# EAGLE board GEVCU-6-2c (EAGLE 6.6.0), part 1 of 2
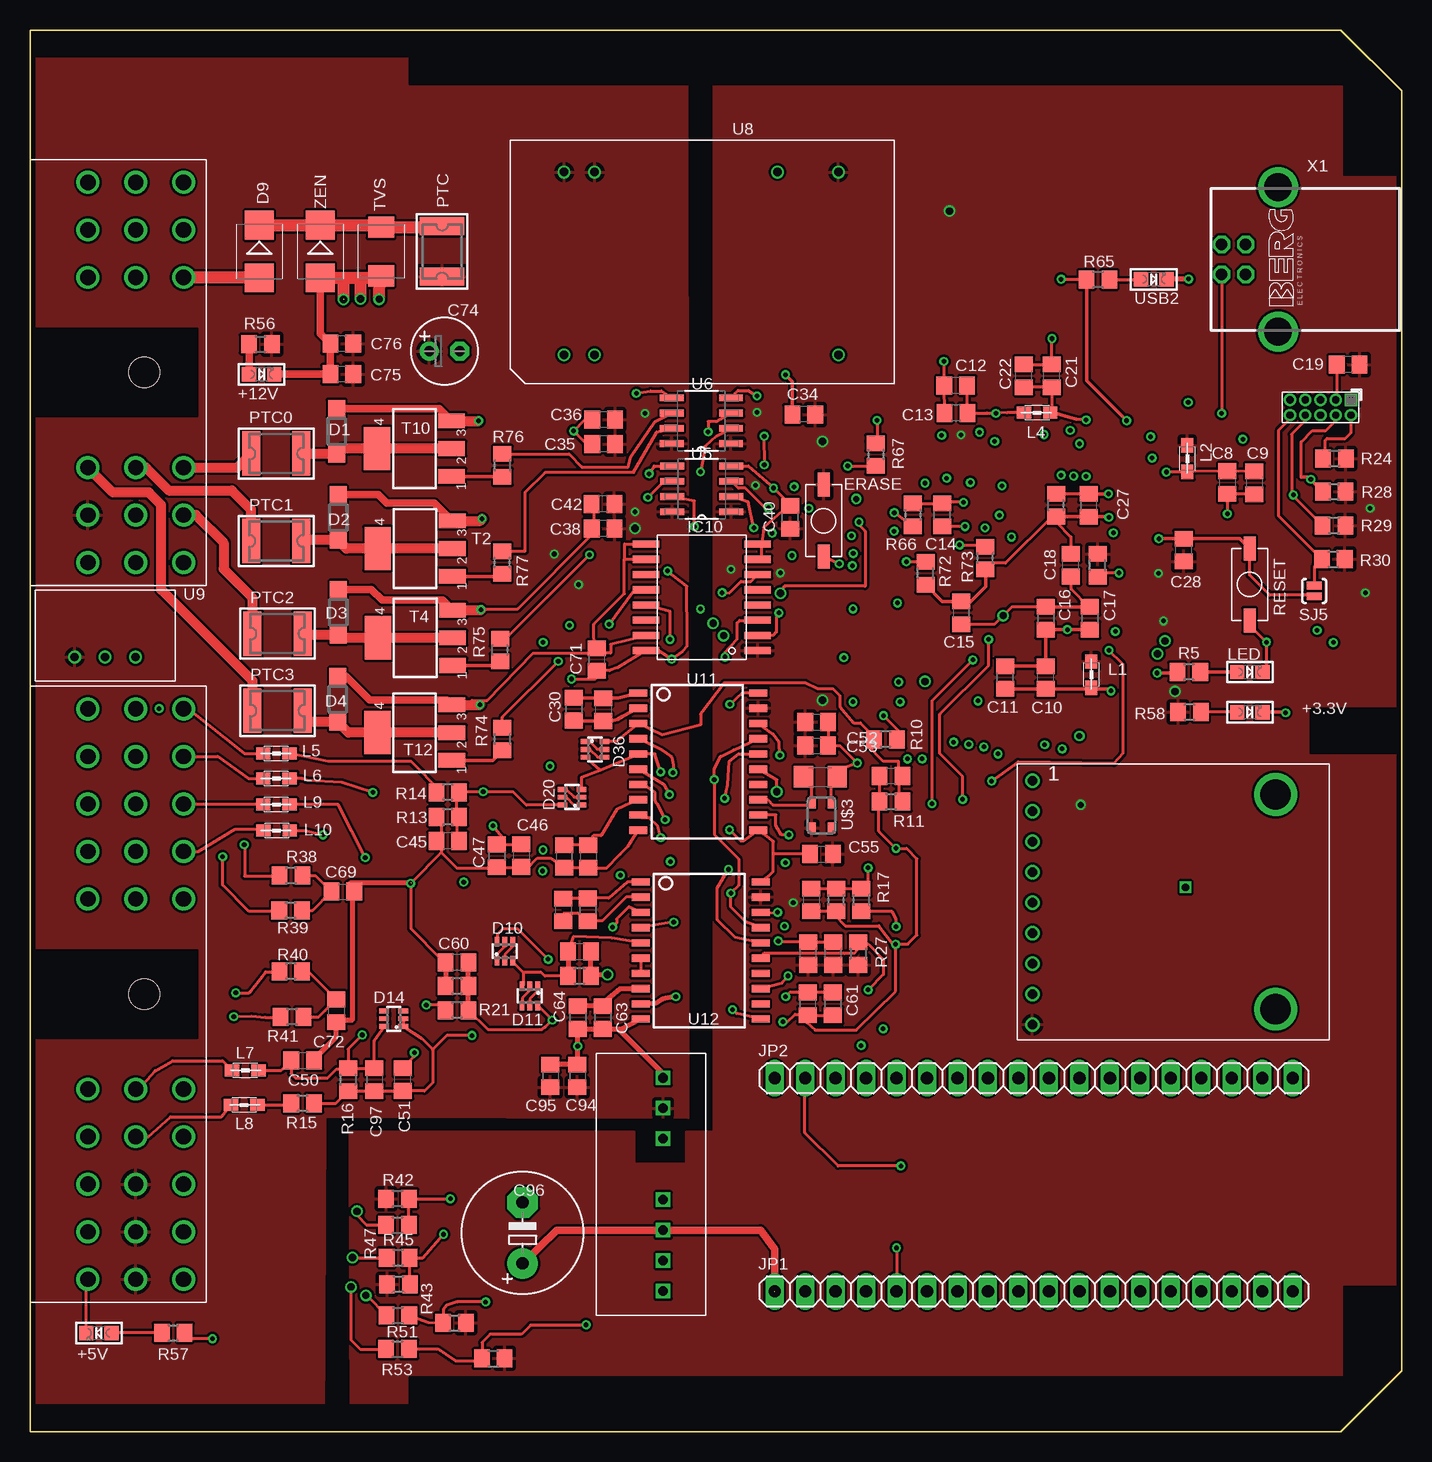
[diagram p2: board, top side]
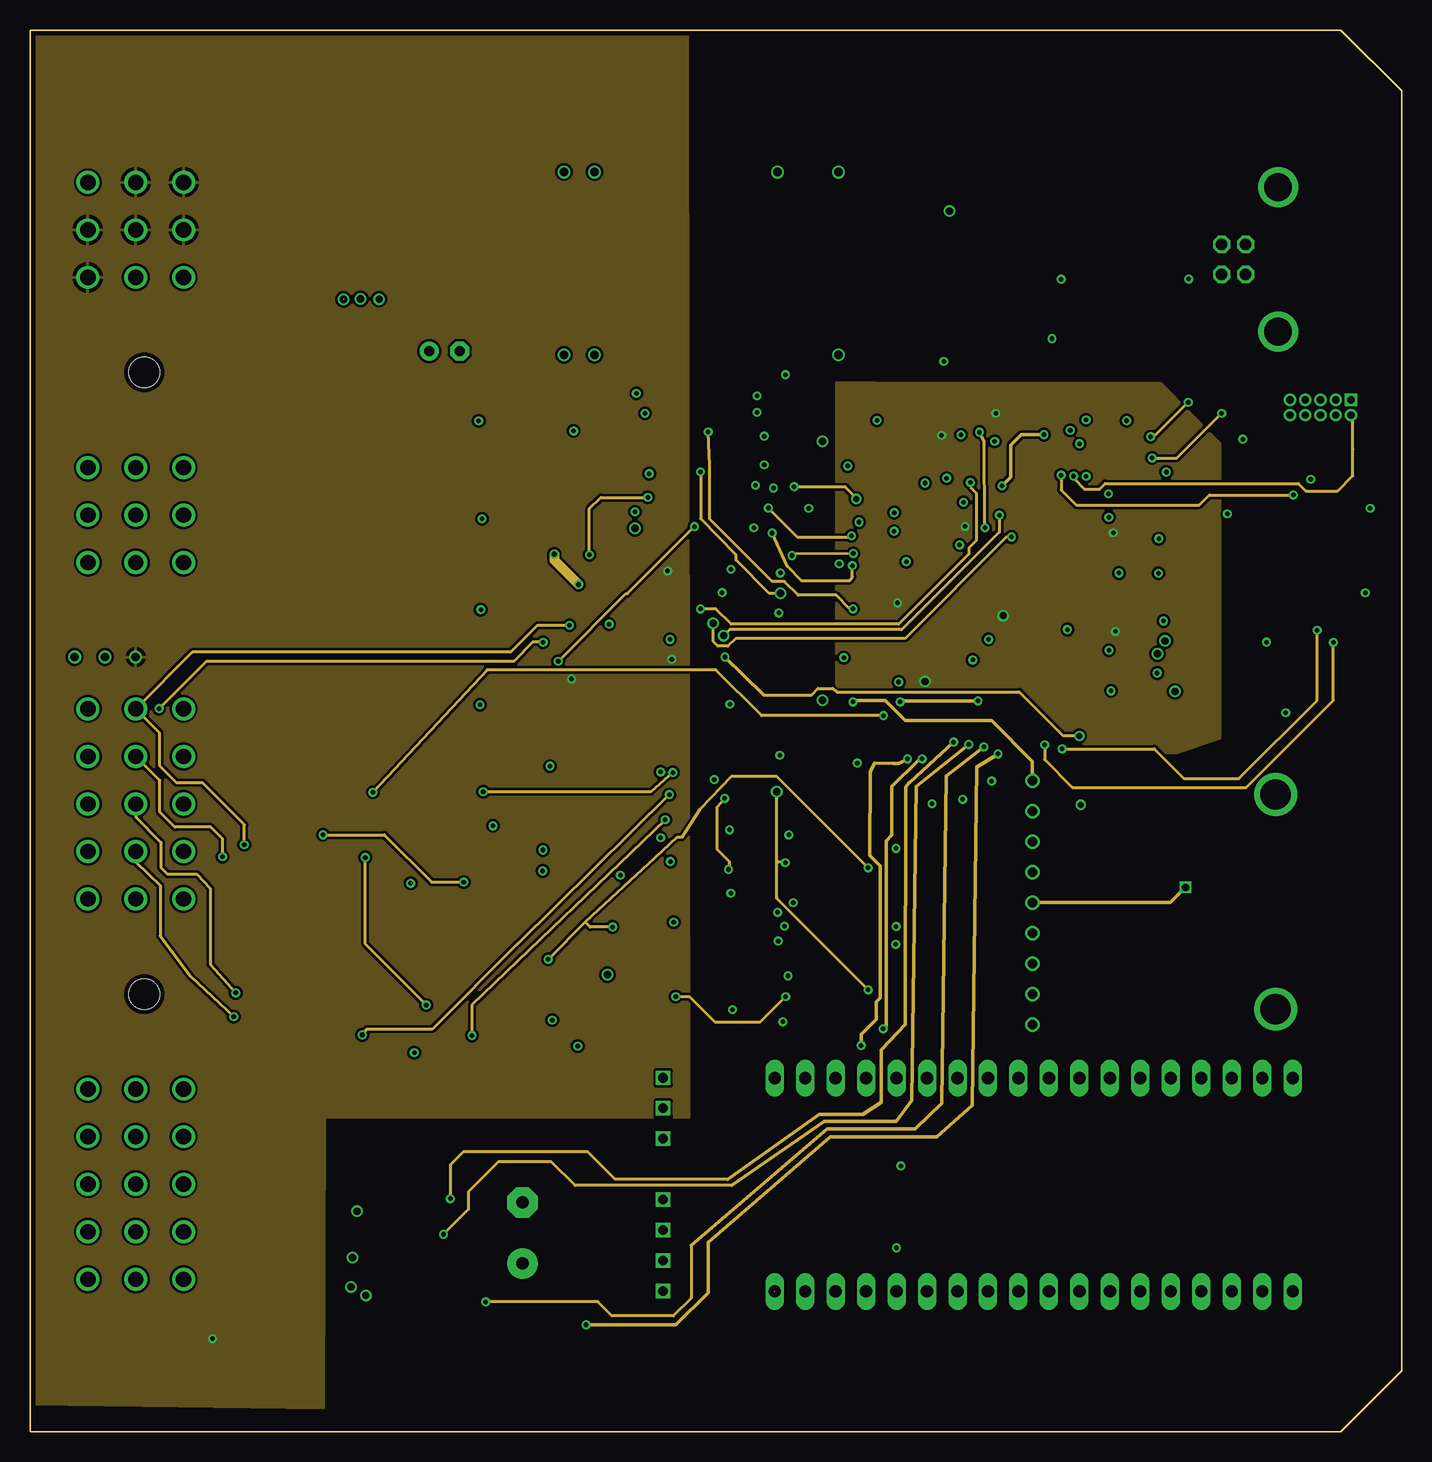
[diagram p3: board, inner layer Route2]
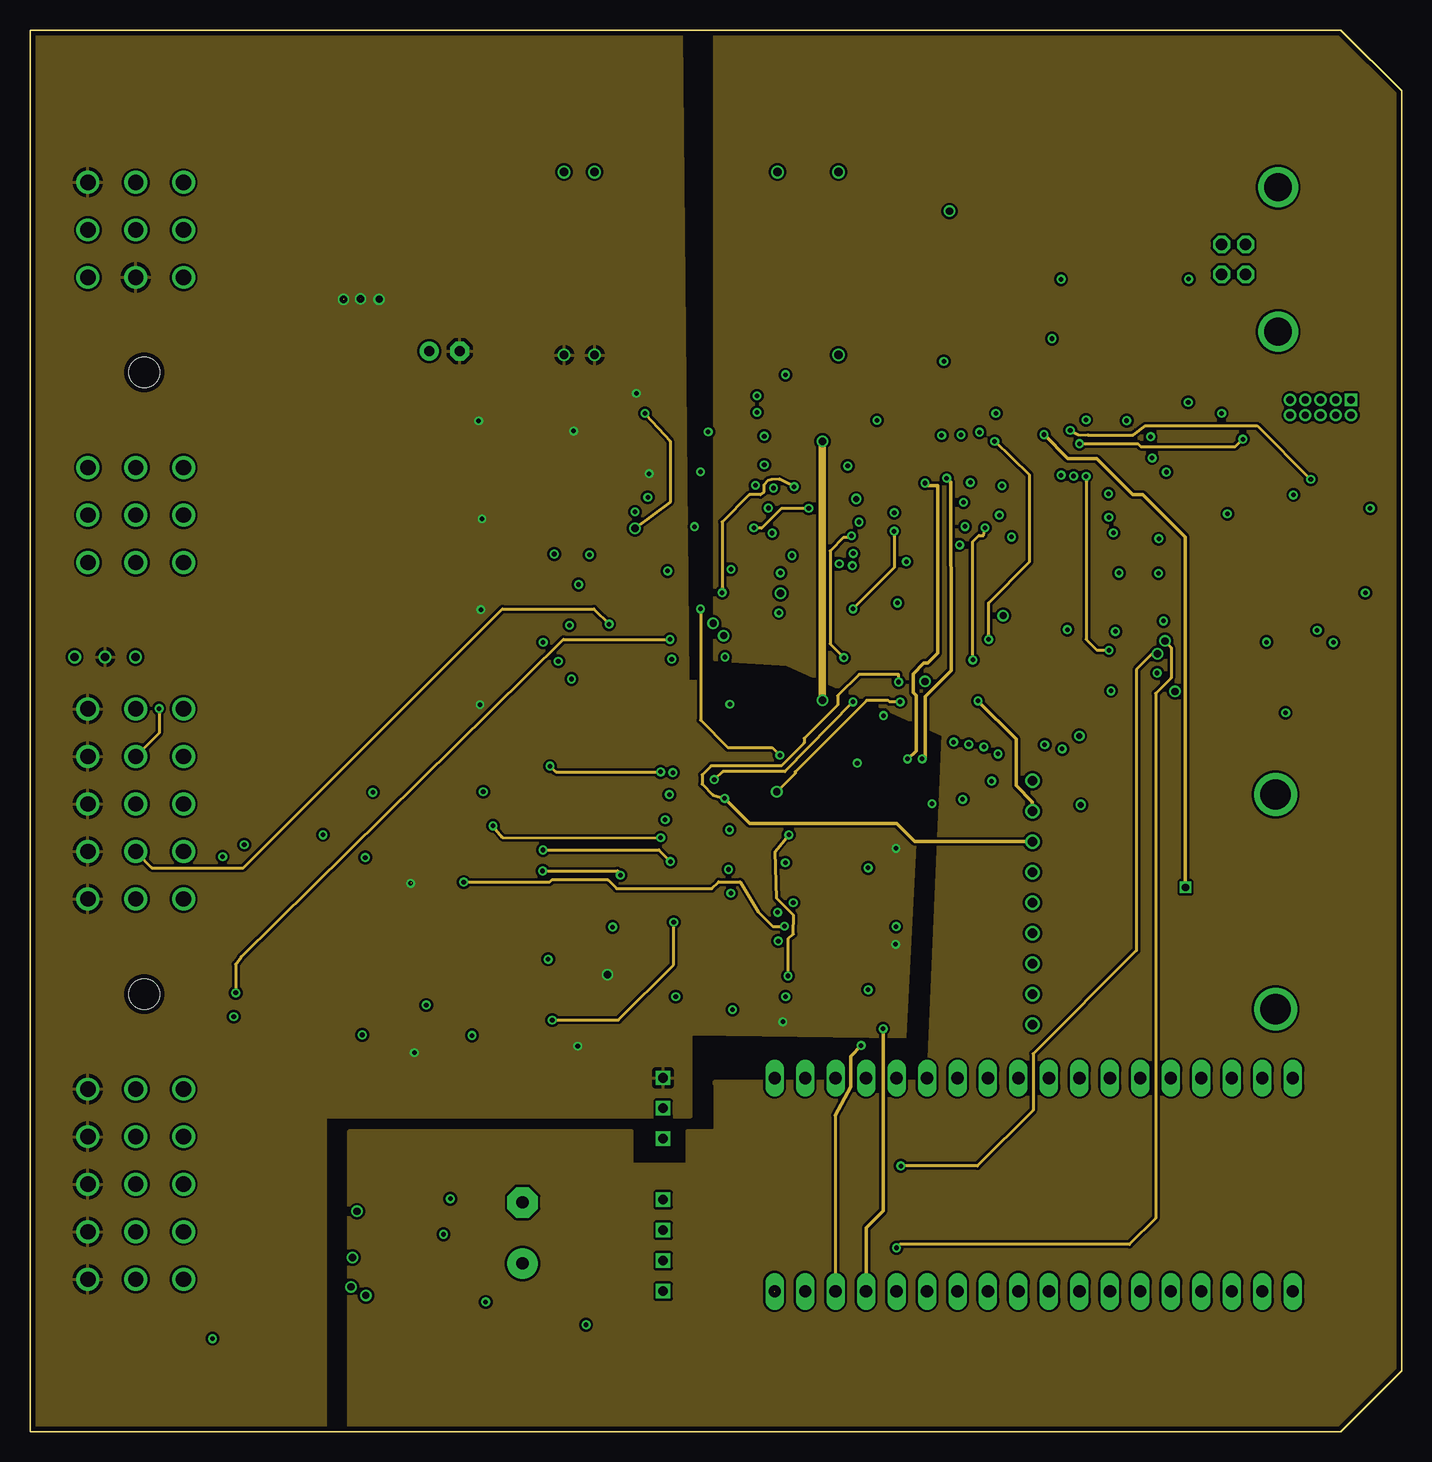
[diagram p4: board, inner layer Route15]
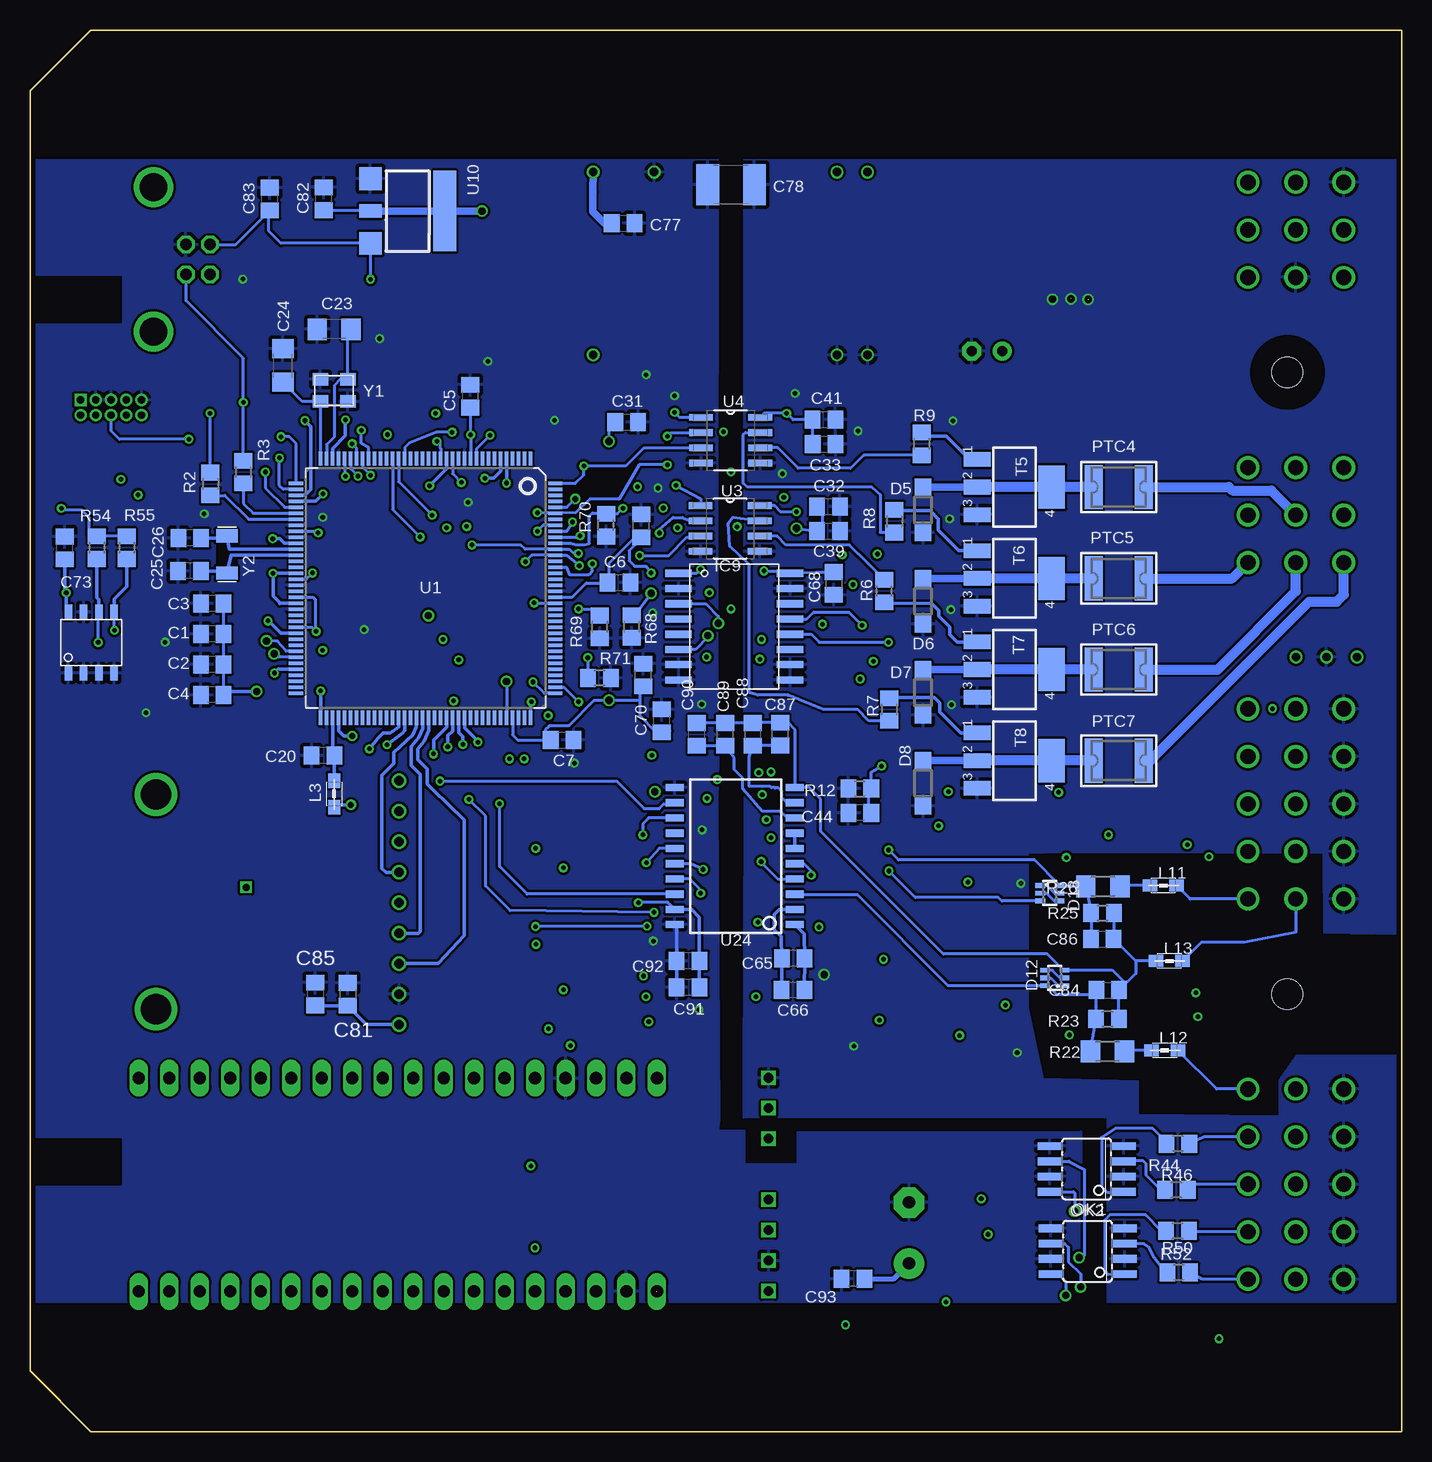
[diagram p5: board, bottom side, seen from below]

Size 114.3 x 116.84 mm. Coordinates in mm from the lower left corner, seen from the top.
Copper layers (1*2*15*16): Top 0.035559375mm / dielectric 0.17018125mm / Route2 0.01778125mm / dielectric 47mil / Route15 0.01778125mm / dielectric 0.17018125mm / Bottom 0.035559375mm
Design rules "OSHPark-4layer *": minimum track width 5mil, minimum drill 10mil, track to track 8mil, track to pad 8mil, pad to pad 8mil, via to via 8mil, smd to smd 5mil, copper to edge 15mil, drill to drill 6mil, minimum pad ring 7mil, minimum via ring 7mil, stop-mask expansion 5mil, vias tented up to drill 0mil, thermal gap 12mil
Net classes: 0 default: width 0.203 mm; 1 USB: drill 0.406 mm, clearance 0.203 mm to class 0, clearance 0.406 mm; 2 gnd: width 0.305 mm, drill 0.406 mm, clearance 0.203 mm to class 0, clearance 0.203 mm; 3 usbvcc: width 0.61 mm, drill 0.508 mm, clearance 0.203 mm to class 0, clearance 0.254 mm

## Footprints (pad centres in the part's own frame; a part is rotated, then mirrored left to right if it is on the bottom)
CHIPLED_0805 = smd 1.2 x 1.2: A 0,-1.05; C 0,1.05
C0805 = smd 1.3 x 1.5: 1 -0.95,0; 2 0.95,0
C1206 = smd 1.6 x 1.8: 1 -1.4,0; 2 1.4,0
E2,5-6 = drill 0.813 pad 1.6: + -1.27,0 | drill 0.813 pad 1.6 octagon: - 1.27,0
C1812 = smd 1.9 x 3.4: 1 -1.95,0; 2 1.95,0
E5-10,5 = drill 1.016 pad 2.54: + -2.54,0 | drill 1.016 pad 2.54 octagon: - 2.54,0
SOD123 = smd 1.4 x 1.4: A 1.9,0; C -1.9,0
SMB = smd 2.4 x 2.4: A 2.2,0; C -2.2,0
SOT363_PHILIPS = smd 0.4 x 0.8: 1 -0.65,-0.8; 2 0,-0.8; 3 0.65,-0.8; 4 0.65,0.8; 5 0,0.8; 6 -0.65,0.8
PUCHBUTTON = smd 2 x 1: P$1 3,0; P$2 -3,0
DUB-R-PDSO-G8 = smd 0.6 x 2.2: 1 -4.445,-4.65; 2 -3.175,-4.65; 3 -1.905,-4.65; 4 -0.635,-4.65; 5 0.635,-4.65; 6 1.905,-4.65; 7 3.175,-4.65; 8 4.445,-4.65; 9 -4.445,4.65; 10 -3.175,4.65; 11 -1.905,4.65; 12 -0.635,4.65; 13 0.635,4.65; 14 1.905,4.65; 15 3.175,4.65; 16 4.445,4.65
1X18 = drill 1.016 long: 1 -21.59,0; 2 -19.05,0; 3 -16.51,0; 4 -13.97,0; 5 -11.43,0; 6 -8.89,0; 7 -6.35,0; 8 -3.81,0; 9 -1.27,0; 10 1.27,0; 11 3.81,0; 12 6.35,0; 13 8.89,0; 14 11.43,0; 15 13.97,0; 16 16.51,0; 17 19.05,0; 18 21.59,0
PINHEAD_2X05_127 = drill 0.6 pad 1.016 square: 1 -0.635,2.54 | drill 0.6 pad 1.016: 2 0.635,2.54; 3 -0.635,1.27; 4 0.635,1.27; 5 -0.635,0; 6 0.635,0; 7 -0.635,-1.27; 8 0.635,-1.27; 9 -0.635,-2.54; 10 0.635,-2.54
0805 = smd 1.2 x 1: 1 -1.1,0; 2 1.1,0
SOIC08 = smd 0.66 x 2.032: 1 -1.905,-3.073; 2 -0.635,-3.073; 3 0.635,-3.073; 4 1.905,-3.073; 5 1.905,3.073; 6 0.635,3.073; 7 -0.635,3.073; 8 -1.905,3.073
PTC1812 = smd 1.5 x 3.7: P$1 -2.1,0; P$2 2.1,0
R0805 = smd 1.3 x 1.5: 1 -0.95,0; 2 0.95,0
R1206 = smd 1.6 x 1.803: 1 -1.422,0; 2 1.422,0
SJ_2S-NO = smd 0.635 x 1.27: 1 -0.45,0; 2 0.45,0
SOT223 = smd 1.219 x 2.235: 1 -2.311,-3.099; 2 0,-3.099; 3 2.311,-3.099 | smd 3.6 x 2.2: 4 0,3.099
SMBJ = smd 1.78 x 2.16: A 2.04,0; C -2.03,0
LQFP144 = smd 0.3 x 1.2: 1 -8.75,-10.8; 2 -8.25,-10.8; 3 -7.75,-10.8; 4 -7.25,-10.8; 5 -6.75,-10.8; 6 -6.25,-10.8; 7 -5.75,-10.8; 8 -5.25,-10.8; 9 -4.75,-10.8; 10 -4.25,-10.8; 11 -3.75,-10.8; 12 -3.25,-10.8; 13 -2.75,-10.8; 14 -2.25,-10.8; 15 -1.75,-10.8; 16 -1.25,-10.8; 17 -0.75,-10.8; 18 -0.25,-10.8; 19 0.25,-10.8; 20 0.75,-10.8; 21 1.25,-10.8; 22 1.75,-10.8; 23 2.25,-10.8; 24 2.75,-10.8; 25 3.25,-10.8; 26 3.75,-10.8; 27 4.25,-10.8; 28 4.75,-10.8; 29 5.25,-10.8; 30 5.75,-10.8; 31 6.25,-10.8; 32 6.75,-10.8; 33 7.25,-10.8; 34 7.75,-10.8; 35 8.25,-10.8; 36 8.75,-10.8; 73 8.75,10.8; 74 8.25,10.8; 75 7.75,10.8; 76 7.25,10.8; 77 6.75,10.8; 78 6.25,10.8; 79 5.75,10.8; 80 5.25,10.8; 81 4.75,10.8; 82 4.25,10.8; 83 3.75,10.8; 84 3.25,10.8; 85 2.75,10.8; 86 2.25,10.8; 87 1.75,10.8; 88 1.25,10.8; 89 0.75,10.8; 90 0.25,10.8; 91 -0.25,10.8; 92 -0.75,10.8; 93 -1.25,10.8; 94 -1.75,10.8; 95 -2.25,10.8; 96 -2.75,10.8; 97 -3.25,10.8; 98 -3.75,10.8; 99 -4.25,10.8; 100 -4.75,10.8; 101 -5.25,10.8; 102 -5.75,10.8; 103 -6.25,10.8; 104 -6.75,10.8; 105 -7.25,10.8; 106 -7.75,10.8; 107 -8.25,10.8; 108 -8.75,10.8 | smd 1.2 x 0.3: 37 10.8,-8.75; 38 10.8,-8.25; 39 10.8,-7.75; 40 10.8,-7.25; 41 10.8,-6.75; 42 10.8,-6.25; 43 10.8,-5.75; 44 10.8,-5.25; 45 10.8,-4.75; 46 10.8,-4.25; 47 10.8,-3.75; 48 10.8,-3.25; 49 10.8,-2.75; 50 10.8,-2.25; 51 10.8,-1.75; 52 10.8,-1.25; 53 10.8,-0.75; 54 10.8,-0.25; 55 10.8,0.25; 56 10.8,0.75; 57 10.8,1.25; 58 10.8,1.75; 59 10.8,2.25; 60 10.8,2.75; 61 10.8,3.25; 62 10.8,3.75; 63 10.8,4.25; 64 10.8,4.75; 65 10.8,5.25; 66 10.8,5.75; 67 10.8,6.25; 68 10.8,6.75; 69 10.8,7.25; 70 10.8,7.75; 71 10.8,8.25; 72 10.8,8.75; 109 -10.8,8.75; 110 -10.8,8.25; 111 -10.8,7.75; 112 -10.8,7.25; 113 -10.8,6.75; 114 -10.8,6.25; 115 -10.8,5.75; 116 -10.8,5.25; 117 -10.8,4.75; 118 -10.8,4.25; 119 -10.8,3.75; 120 -10.8,3.25; 121 -10.8,2.75; 122 -10.8,2.25; 123 -10.8,1.75; 124 -10.8,1.25; 125 -10.8,0.75; 126 -10.8,0.25; 127 -10.8,-0.25; 128 -10.8,-0.75; 129 -10.8,-1.25; 130 -10.8,-1.75; 131 -10.8,-2.25; 132 -10.8,-2.75; 133 -10.8,-3.25; 134 -10.8,-3.75; 135 -10.8,-4.25; 136 -10.8,-4.75; 137 -10.8,-5.25; 138 -10.8,-5.75; 139 -10.8,-6.25; 140 -10.8,-6.75; 141 -10.8,-7.25; 142 -10.8,-7.75; 143 -10.8,-8.25; 144 -10.8,-8.75
SOIC127P600X175-8N = smd 1.981 x 0.559: 1 -2.464,1.905; 2 -2.464,0.635; 3 -2.464,-0.635; 4 -2.464,-1.905; 5 2.464,-1.905; 6 2.464,-0.635; 7 2.464,0.635; 8 2.464,1.905
CK_CUSTOM_SOIC8 = smd 0.635 x 1.27: PIN1 -1.905,-2.54; PIN2 -0.635,-2.54; PIN3 0.635,-2.54; PIN4 1.905,-2.54; PIN5 1.905,2.54; PIN6 0.635,2.54; PIN7 -0.635,2.54; PIN8 -1.905,2.54
TRACO = drill 0.7: +VIN1 -11.375,7.48; +VIN2 -8.835,7.48; +VOUT 11.485,7.48; -VIN1 -11.375,-7.76; -VIN2 -8.835,-7.76; -VOUT 6.405,7.48; P$6 11.485,-7.76
TSR-1 = drill 0.7: P$1 -2.55,-1.8; P$2 -0.01,-1.8; P$3 2.53,-1.8
SOT223-W = smd 1.9 x 1.9: 1 -2.7,-3.1; 3 2.7,-3.1 | smd 1.1 x 1.9: 2 0,-3.1 | smd 6.7 x 1.9: 4 0,3.1
SOIC20 = smd 0.6 x 1.5: 1 0.635,-1.19; 2 1.905,-1.19; 3 3.175,-1.19; 4 4.445,-1.19; 5 5.715,-1.19; 6 6.985,-1.19; 7 8.255,-1.19; 8 9.525,-1.19; 9 10.795,-1.19; 10 12.065,-1.19; 11 12.065,8.81; 12 10.795,8.81; 13 9.525,8.81; 14 8.255,8.81; 15 6.985,8.81; 16 5.715,8.81; 17 4.445,8.81; 18 3.175,8.81; 19 1.905,8.81; 20 0.635,8.81
CINCON5V = drill 0.8 square: P$1 2.032,5.588; P$2 4.572,5.588; P$3 7.112,5.588; P$4 12.192,5.588; P$5 14.732,5.588; P$6 17.272,5.588; P$7 19.812,5.588
581_01_48_005_S = drill 1.27: P$1 104.14,101.498; P$2 100.178,101.498; P$3 96.215,101.498; P$4 80.366,101.498; P$5 76.403,101.498; P$6 72.441,101.498; P$7 104.14,105.486; P$8 100.178,105.486; P$9 96.215,105.486; P$10 80.366,105.486; P$11 76.403,105.486; P$12 72.441,105.486; P$13 104.14,109.474; P$14 100.178,109.474; P$15 96.215,109.474; P$16 80.366,109.474; P$17 76.403,109.474; P$18 72.441,109.474; P$19 60.249,101.498; P$20 56.286,101.498; P$21 52.324,101.498; P$22 48.362,101.498; P$23 44.399,101.498; P$24 28.55,101.498; P$25 24.587,101.498; P$26 20.625,101.498; P$27 16.662,101.498; P$28 12.7,101.498; P$29 60.249,105.486; P$30 56.286,105.486; P$31 52.324,105.486; P$32 48.362,105.486; P$33 44.399,105.486; P$34 28.55,105.486; P$35 24.587,105.486; P$36 20.625,105.486; P$37 16.662,105.486; P$38 12.7,105.486; P$39 60.249,109.474; P$40 56.286,109.474; P$41 52.324,109.474; P$42 48.362,109.474; P$43 44.399,109.474; P$44 28.55,109.474; P$45 24.587,109.474; P$46 20.625,109.474; P$47 16.662,109.474; P$48 12.7,109.474 | hole 2.54: 36.474,104.775; 88.29,104.775
ASE = smd 0.9 x 0.65: 1 -1.05,-0.825; 2 1.05,-0.825; 3 1.05,0.825; 4 -1.05,0.825
BLE_SPI = drill 0.8: P$1 1.27,21.59; P$2 1.27,19.05; P$3 1.27,16.51; P$4 1.27,13.97; P$5 1.27,11.43; P$6 1.27,8.89; P$7 1.27,6.35; P$8 1.27,3.81; P$9 1.27,1.27 | drill 2.54: P$10 21.539,20.447; P$11 21.539,2.54
PN61729-S = drill 0.95 octagon: 1 1.25,4.71; 2 -1.25,4.71; 3 -1.25,2.71; 4 1.25,2.71 | drill 2.3 pad 2.9: S1 -6.02,0; S2 6.02,0
CRYSTAL-3.2-2.5 = smd 1.3 x 1.05: 1 -1.15,-0.925; 2 1.15,-0.925; 3 1.15,0.925; 4 -1.15,0.925
ARDUINO_WIFI_SHIELD_V018_TG_RESONATOR_EPSON_FC_145 = smd 1.1 x 1.8: P$1 -1.55,0; P$2 1.55,0

## Placement (x,y rotation side)
+3.3V  [CHIPLED_0805]  101.65,59.97 270 top
+5V  [CHIPLED_0805]  5.74,8.22 90 top
+12V  [CHIPLED_0805]  19.3,88.14 270 top
C1  10u  [C0805]  99.11,66.5 180 bottom
C2  0.1u  [C0805]  99.11,63.96 180 bottom
C3  0.1u  [C0805]  99.11,69.04 180 bottom
C4  0.1u  [C0805]  99.11,61.42 180 bottom
C5  0.1u  [C0805]  77.6,86.31 90 bottom
C6  0.1u  [C0805]  65.21,70.76 0 bottom
C7  0.1u  [C0805]  69.95,57.66 0 bottom
C8  0.1u  [C0805]  99.78,79.12 270 top
C9  10u  [C0805]  102.03,79.1 270 top
C10  0.1u  [C0805]  84.63,62.87 90 top
C11  10u  [C0805]  81.27,62.87 90 top
C12  10u  [C0805]  77.14,87.2 180 top
C13  0.1u  [C0805]  77.17,84.91 180 top
C14  0.1u  [C0805]  76.02,76.42 90 top
C15  0.1u  [C0805]  77.62,68.25 90 top
C16  0.1u  [C0805]  84.63,67.79 270 top
C17  0.1u  [C0805]  88.32,67.79 270 top
C18  0.1u  [C0805]  86.74,72.22 90 top
C19  0.1u  [C0805]  109.84,88.95 180 top
C20  0.1u  [C0805]  89.89,56.36 180 bottom
C21  0.1u  [C0805]  85.14,88.01 90 top
C22  10u  [C0805]  82.82,88.01 90 top
C23  22p  [C1206]  88.95,91.9 180 bottom
C24  22p  [C1206]  93.22,88.87 90 bottom
C25  22p  [C0805]  101.02,71.75 180 bottom
C26  22p  [C0805]  100.99,74.47 180 bottom
C27  22p  [C0805]  88.21,77.22 270 top
C28  0.01u  [C0805]  96.14,73.48 90 top
C29  0.1u  [C0805]  47.76,60.19 270 top
C30  10u  [C0805]  45.3,60.22 270 top
C31  0.1u  [C0805]  64.58,84.16 0 bottom
C32  0.1u  [C0805]  47.76,77.1 0 bottom
C33  10u  [C0805]  48.13,84.35 0 bottom
C34  0.1u  [C0805]  64.49,84.8 180 top
C35  0.1u  [C0805]  47.8,82.31 180 top
C36  10u  [C0805]  47.8,84.34 180 top
C37  0.1u  [C0805]  63.37,75.5 90 bottom
C38  0.1u  [C0805]  47.75,77.32 180 top
C39  10u  [C0805]  47.76,75.08 0 bottom
C40  0.1u  [C0805]  63.35,76.21 90 top
C41  0.1u  [C0805]  48.12,82.32 0 bottom
C42  10u  [C0805]  47.76,75.29 180 top
C43  .1u  [C0805]  71.75,54.64 180 top
C44  .1u  [C0805]  45.15,51.59 180 bottom
C45  .1u  [C0805]  34.81,49.23 180 top
C46  0.1u  [C0805]  40.93,48.02 270 top
C47  4.7u  [C0805]  38.9,47.99 270 top
C48  4.7u  [C0805]  44.5,47.94 270 top
C49  0.1u  [C0805]  46.52,47.94 270 top
C50  0.033u  [C0805]  22.72,30.94 0 top
C51  0.033u  [C0805]  31.06,29.35 90 top
C52  0.1u  [C0805]  65.56,59.16 0 top
C53  10u  [C0805]  65.56,57.18 0 top
C54  22p  [C1206]  65.86,54.58 0 top
C55  0.1u  [C0805]  65.96,48.16 0 top
C56  0.1u  [C0805]  46.47,43.5 270 top
C57  10u  [C0805]  44.45,43.48 270 top
C58  .1u  [C0805]  65.1,44.32 270 top
C59  0.1u  [C0805]  45.8,40.02 0 top
C60  .1u  [C0805]  35.59,39.12 180 top
C61  0.1u  [C0805]  66.9,35.66 270 top
C62  4.7u  [C0805]  64.8,35.66 270 top
C63  4.7u  [C0805]  47.73,34.52 270 top
C64  0.1u  [C0805]  45.64,34.52 270 top
C65  0.1u  [C0805]  50.7,39.45 180 bottom
C66  10u  [C0805]  50.72,36.8 180 bottom
C67  0.1u  [C0805]  63.21,63.07 90 bottom
C68  0.1u  [C0805]  47.32,70.7 270 bottom
C69  47n  [C0805]  26.07,45.01 0 top
C70  0.1u  [C0805]  61.65,59.26 90 bottom
C71  0.1u  [C0805]  47.24,64.36 90 top
C72  47n  [C0805]  25.53,35.08 270 top
C73  0.1u  [C0805]  111.4,73.66 90 bottom
C74  100u  [E2,5-6]  34.54,90.07 0 top
C75  1u  [C0805]  25.98,88.14 180 top
C76  0.1u  [C0805]  25.98,90.68 180 top
C77  2u  [C0805]  64.87,100.74 0 bottom
C78  0.01u  [C1812]  55.88,103.94 180 bottom
C79  0.1u  [C0805]  64.85,39.85 90 top
C80  10u  [C0805]  66.93,39.85 90 top
C81  0.1u  [C0805]  87.83,36.45 270 bottom
C82  10uF  [C0805]  89.81,102.77 90 bottom
C83  10uF  [C0805]  94.31,102.74 90 bottom
C84  .1u  [C0805]  24.49,36.8 0 bottom
C85  10u  [C0805]  90.53,36.47 270 bottom
C86  .1u  [C0805]  24.94,41.07 0 bottom
C87  0.1u  [C0805]  51.79,58.14 90 bottom
C88  4.7u  [C0805]  54.05,58.12 90 bottom
C89  4.7u  [C0805]  56.36,58.12 90 bottom
C90  0.1u  [C0805]  58.72,58.12 90 bottom
C91  0.1u  [C0805]  59.46,37.03 180 bottom
C92  10u  [C0805]  59.46,39.24 180 bottom
C93  1u  [C0805]  45.72,12.75 180 bottom
C94  10u  [C0805]  45.62,29.65 270 top
C95  0.1u  [C0805]  43.37,29.65 270 top
C96  680u  [E5-10,5]  41.05,16.56 90 top
C97  0.1u  [C0805]  28.7,29.34 270 top
D1  MBR0520LT  [SOD123]  25.55,83.39 90 top
D2  MBR0520LT  [SOD123]  25.68,76.2 90 top
D3  MBR0520LT  [SOD123]  25.68,68.3 90 top
D4  MBR0520LT  [SOD123]  25.65,61.04 90 top
D5  MBR0520LT  [SOD123]  39.88,76.83 270 bottom
D6  MBR0520LT  [SOD123]  39.88,69.22 270 bottom
D7  MBR0520LT  [SOD123]  39.88,61.62 270 bottom
D8  MBR0520LT  [SOD123]  39.88,54.05 270 bottom
D9  B360B-13-F  [SMB]  19.1,98.37 270 top
D10  BAS70XY  [SOT363_PHILIPS]  39.57,40.06 0 top
D11  BAS70XY  [SOT363_PHILIPS]  41.66,36.32 180 top
D12  BAS70XY  [SOT363_PHILIPS]  28.91,37.82 90 bottom
D13  BAS70XY  [SOT363_PHILIPS]  29.31,44.88 270 bottom
D14  BAS70XY  [SOT363_PHILIPS]  30.3,34.42 90 top
D20  BAS70XY  [SOT363_PHILIPS]  45.16,52.88 90 top
D36  BAS70XY  [SOT363_PHILIPS]  47.09,56.87 270 top
ERASE  PUCHBUTTON  [PUCHBUTTON]  66.14,75.93 270 top
IC9  ISO1050DW  [DUB-R-PDSO-G8]  55.6,67.11 270 bottom
IC10  ISO1050DW  [DUB-R-PDSO-G8]  55.98,69.55 90 top
JP1  [1X18]  83.64,11.68 0 top
JP2  [1X18]  83.64,29.46 0 top
JTAG  [PINHEAD_2X05_127]  107.54,85.37 270 top
L1  MH2029-300Y  [0805]  88.44,63.09 270 top
L2  MH2029-300Y  [0805]  96.44,81.1 270 top
L3  MH2029-300Y  [0805]  88.95,53.16 90 bottom
L4  MH2029-300Y  [0805]  83.92,84.94 0 top
L5  MH2029-300Y  [0805]  20.54,56.53 0 top
L6  MH2029-300Y  [0805]  20.54,54.44 0 top
L7  MH2029-300Y  [0805]  17.95,30.11 180 top
L8  MH2029-300Y  [0805]  17.84,27.22 180 top
L9  MH2029-300Y  [0805]  20.54,52.27 0 top
L10  MH2029-300Y  [0805]  20.55,50.1 0 top
L11  MH2029-300Y  [0805]  19.85,45.52 180 bottom
L12  MH2029-300Y  [0805]  19.75,31.78 180 bottom
L13  MH2029-300Y  [0805]  19.35,39.23 180 bottom
LED  [CHIPLED_0805]  101.65,63.32 270 top
OK1  ILD213  [SOIC08]  26.24,21.89 90 bottom
OK2  ILD213  [SOIC08]  26.16,15.04 90 bottom
PTC  2.5A  [PTC1812]  34.34,98.37 90 top
PTC0  2.5A  [PTC1812]  20.52,81.53 0 top
PTC1  2.5A  [PTC1812]  20.52,74.24 0 top
PTC2  2.5A  [PTC1812]  20.62,66.52 0 top
PTC3  2.5A  [PTC1812]  20.62,60.1 0 top
PTC4  2.5A  [PTC1812]  23.57,78.74 180 bottom
PTC5  2.5A  [PTC1812]  23.57,71.12 180 bottom
PTC6  2.5A  [PTC1812]  23.57,63.53 180 bottom
PTC7  2.5A  [PTC1812]  23.57,55.93 180 bottom
R1  100k  [R0805]  88.96,72.21 90 top
R2  39R 1%  [R0805]  99.26,78.99 270 bottom
R3  39R 1%  [R0805]  96.52,79.98 270 bottom
R4  6k8 1%  [R0805]  85.51,77.23 90 top
R5  402R  [R0805]  96.57,63.32 180 top
R6  10  [R0805]  43.12,70.07 90 bottom
R7  10  [R0805]  42.7,60.2 270 bottom
R8  10  [R0805]  42.27,75.9 270 bottom
R9  10  [R0805]  40.01,82.35 270 bottom
R10  14k .1%  [R0805]  71.3,57.71 180 top
R11  1k .1%  [R0805]  71.75,52.53 0 top
R12  0R  [R0805]  45.15,53.59 0 bottom
R13  1k .1%  [R0805]  34.81,51.24 180 top
R14  14k .1%  [R0805]  34.81,53.29 180 top
R15  1k .1%  [R0805]  22.72,27.37 180 top
R16  750R .1%  [R0805]  26.5,29.34 270 top
R17  14k .1%  [R0805]  69.29,44.32 90 top
R18  1k .1%  [R0805]  67.18,44.32 90 top
R19  0R  [R0805]  45.8,37.97 180 top
R20  1k .1%  [R0805]  35.59,37.13 180 top
R21  14k .1%  [R0805]  35.59,35.13 180 top
R22  1M 0.1%  [R1206]  24.51,31.7 180 bottom
R23  1.5K 0.1%  [R0805]  24.51,34.39 180 bottom
R24  100k  [R0805]  108.71,81.13 0 top
R25  1.5K 0.1%  [R0805]  24.92,43.23 0 bottom
R26  1M 0.1%  [R1206]  24.89,45.44 0 bottom
R27  10k  [R0805]  69.01,39.85 270 top
R28  100k  [R0805]  108.69,78.36 0 top
R29  100k  [R0805]  108.66,75.54 0 top
R30  100k  [R0805]  108.61,72.72 0 top
R38  60R  [R0805]  21.74,46.34 180 top
R39  60R  [R0805]  21.72,43.45 180 top
R40  60R  [R0805]  21.73,38.38 180 top
R41  60R  [R0805]  21.83,34.57 180 top
R42  10k  [R0805]  30.63,19.41 180 top
R43  10k  [R0805]  30.71,12.27 180 top
R44  1k  [R0805]  18.64,24 180 bottom
R45  1k  [R0805]  30.63,17.22 0 top
R46  1k  [R0805]  18.77,20.14 180 bottom
R47  1k  [R0805]  30.68,14.5 0 top
R48  10k  [R0805]  35.38,9.07 0 top
R49  10k  [R0805]  38.61,6.1 0 top
R50  1k  [R0805]  18.67,16.74 180 bottom
R51  1k  [R0805]  30.66,9.7 0 top
R52  1k  [R0805]  18.57,13.26 180 bottom
R53  1k  [R0805]  30.63,6.88 0 top
R54  4.7k  [R0805]  108.74,73.69 270 bottom
R55  4.7k  [R0805]  106.25,73.69 270 bottom
R56  3k3  [R0805]  19.2,90.65 0 top
R57  1k  [R0805]  11.94,8.24 0 top
R58  402R  [R0805]  96.62,59.97 180 top
R65  1k  [R0805]  89,96.04 180 top
R66  10k  [R0805]  73.57,76.42 270 top
R67  10k  [R0805]  70.47,81.45 270 top
R68  10k  [R0805]  64.16,67.11 90 bottom
R69  10k  [R0805]  66.83,67.08 90 bottom
R70  10k  [R0805]  66.29,75.56 90 bottom
R71  10k  [R0805]  66.84,62.83 180 bottom
R72  10k  [R0805]  74.63,71.55 90 top
R73  10k  [R0805]  79.6,72.82 90 top
R74  10  [R0805]  39.37,57.73 90 top
R75  10  [R0805]  39.17,65.15 90 top
R76  10  [R0805]  39.37,80.54 90 top
R77  10  [R0805]  39.34,72.44 90 top
RESET  PUCHBUTTON  [PUCHBUTTON]  101.63,70.62 270 top
SJ5  SOLDERJUMPERNO  [SJ_2S-NO]  107.01,70.08 270 top
T2  [SOT223]  32.08,73.61 90 top
T4  [SOT223]  32.11,66.17 90 top
T5  [SOT223]  32.26,78.74 270 bottom
T6  [SOT223]  32.26,71.12 270 bottom
T7  [SOT223]  32.26,63.53 270 bottom
T8  [SOT223]  32.26,55.93 270 bottom
T10  [SOT223]  32.03,81.94 90 top
T12  [SOT223]  32.05,58.27 90 top
TVS  SMBJ15A-TR  [SMBJ]  29.26,98.37 270 top
U1  ATSAM3X8EA-AU  [LQFP144]  81.33,70.31 180 bottom
U3  ADUM3221BRZ  [SOIC127P600X175-8N]  55.96,75.29 0 bottom
U4  ADUM3221BRZ  [SOIC127P600X175-8N]  55.92,82.64 0 bottom
U5  ADUM3221BRZ  [SOIC127P600X175-8N]  55.98,78.59 180 top
U6  ADUM3221BRZ  [SOIC127P600X175-8N]  55.94,84.26 180 top
U7  CK_CUSTOM_M24M02-DRMN6TP  [CK_CUSTOM_SOIC8]  109.19,65.79 0 bottom
U8  TRACO  [TRACO]  55.88,97.51 0 top
U9  TSR-1  [TSR-1]  6.27,66.37 0 top
U10  [SOT223-W]  82.83,101.75 270 bottom
U11  ADE7913  [SOIC20]  51.89,62.2 270 top
U12  ADE7913  [SOIC20]  52.07,46.46 270 top
U24  ADE7913  [SOIC20]  51.77,41.63 90 bottom
U$1  CINCON5V  [CINCON5V]  47.17,31.52 270 top
U$2  581_01_48_005_S  [581_01_48_005_S]  114.3,0 90 top
U$3  ASE  [ASE]  65.96,51.36 90 top
U$4  BLE_SPI  [BLE_SPI]  82.27,32.66 0 top
USB2  [CHIPLED_0805]  93.65,96.06 270 top
X1  PN61729-S  [PN61729-S]  104.01,97.71 90 top
Y1  12MHz KX-7 20pF  [CRYSTAL-3.2-2.5]  88.95,86.79 0 bottom
Y2  32.768Khz  [ARDUINO_WIFI_SHIELD_V018_TG_RESONATOR_EPSON_FC_145]  97.89,73.13 90 bottom
ZEN  1SMB5929BT3G  [SMB]  24.18,98.37 270 top